# Altium schematic sheet Memory.SchDoc
size Legal; Author: Mark & Qiming; DocumentNumber: 2; SheetNumber: 2; SheetTotal: 9
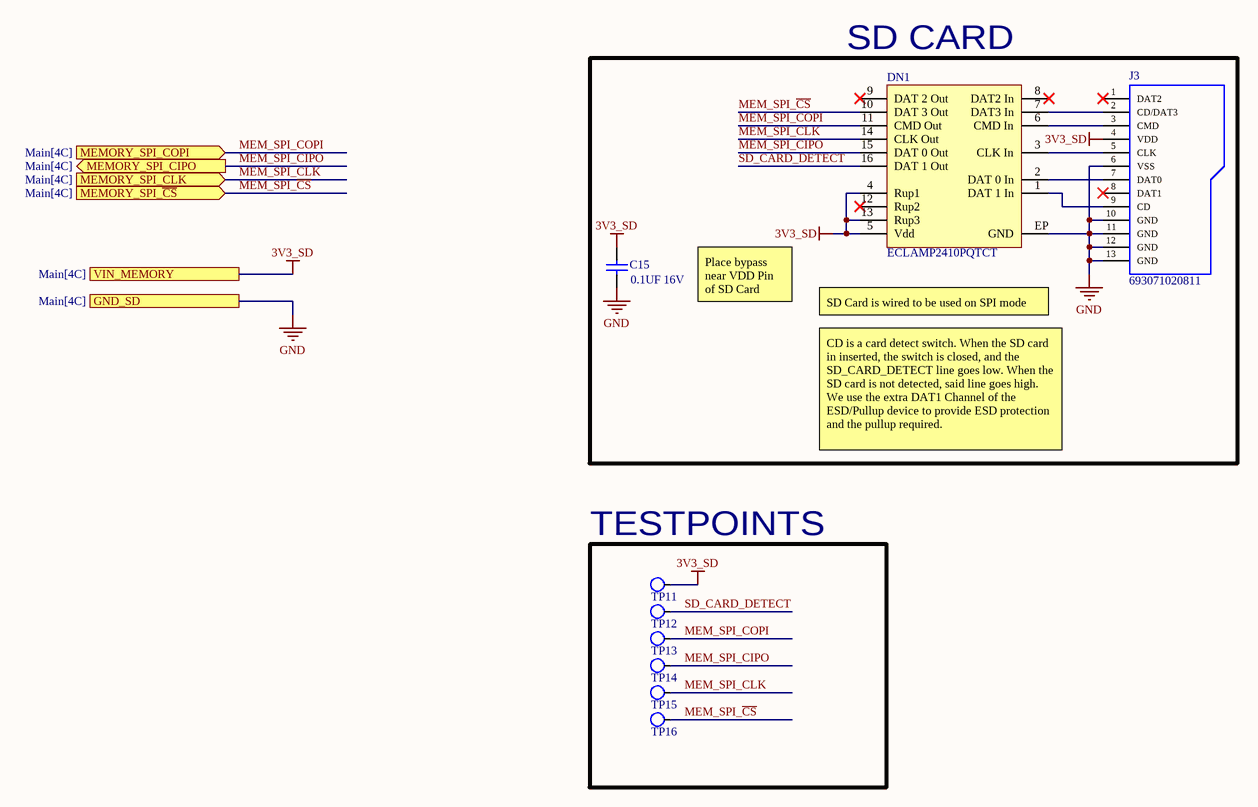
[diagram p0: Memory.SchDoc]

## Parts
C15  0.1UF 16V  [0603_CAP]
DN1  ECLAMP2410PQTCT  [ECLAMP2410PQTCT-Footprint-1]
J3  693071020811  [693071020811]
TP11  Testpad  [SMT Testpoint, 50mil]  (value not drawn)  (no BOM)
TP12  Testpad  [SMT Testpoint, 50mil]  (value not drawn)  (no BOM)
TP13  Testpad  [SMT Testpoint, 50mil]  (value not drawn)  (no BOM)
TP14  Testpad  [SMT Testpoint, 50mil]  (value not drawn)  (no BOM)
TP15  Testpad  [SMT Testpoint, 50mil]  (value not drawn)  (no BOM)
TP16  Testpad  [SMT Testpoint, 50mil]  (value not drawn)  (no BOM)

## Blocks framed on the sheet
SD CARD: C15 DN1 J3
TESTPOINTS: TP11-TP16

## Ports
GND_SD (see Main[4C]), MEMORY_SPI_CIPO (out, see Main[4C]), MEMORY_SPI_CLK (in, see Main[4C]), MEMORY_SPI_COPI (in, see Main[4C]), MEMORY_SPI_~{CS} (in, see Main[4C]), VIN_MEMORY (see Main[4C])

## Nets
3V3_SD: C15.2 DN1.4(Rup1) DN1.5(Vdd) DN1.13(Rup3) J3.4(VDD) TP11.1 ; port VIN_MEMORY
GND: C15.1 DN1.EP(GND) J3.6(VSS) J3.10(GND) J3.11(GND) J3.12(GND) J3.13(GND) ; port GND_SD
MEM_SPI_~{CS}: DN1.10(DAT_3_Out) TP16.1 ; port MEMORY_SPI_~{CS}
MEM_SPI_CIPO: DN1.15(DAT_0_Out) TP14.1 ; port MEMORY_SPI_CIPO
MEM_SPI_CLK: DN1.14(CLK_Out) TP15.1 ; port MEMORY_SPI_CLK
MEM_SPI_COPI: DN1.11(CMD_Out) TP13.1 ; port MEMORY_SPI_COPI
SD_CARD_DETECT: DN1.16(DAT_1_Out) TP12.1
NetDN1_1: DN1.1(DAT_1_In) J3.9(CD)
NetDN1_2: DN1.2(DAT_0_In) J3.7(DAT0)
NetDN1_3: DN1.3(CLK_In) J3.5(CLK)
NetDN1_6: DN1.6(CMD_In) J3.3(CMD)
NetDN1_7: DN1.7(DAT3_In) J3.2(CD/DAT3)

Not connected (* = marked no-connect by the designer): DN1 8(DAT2_In)* 9(DAT_2_Out)* 12(Rup2)*; J3 1(DAT2)* 8(DAT1)*

## Notes on the sheet
- Place bypass near VDD Pin of SD Card
- SD Card is wired to be used on SPI mode
- CD is a card detect switch. When the SD card in inserted, the switch is closed, and the SD_CARD_DETECT line goes low. When the SD card is not detected, said line goes high. We use the extra DAT1 Channel of the ESD/Pullup device to provide ESD protection and the pullup required.
- Title:
- Desc:
- Size:
- Letter
- Auth:
- Proj:
- Sheet
- of
- www.seas.upenn.edu
- Electrical and Systems Engineering

## Library data of the parts
C15 = CMP-011-000221-1: Capacitor Surface Mount 0603 Footprint 0.1UF 16V 10% Tolerance Ceramic X7R; Manufacturer P/N: CAP 0603 0.1UF 16V 10% X7R; Manufacturer: Various; Description in Visual: Cap SMT 0603 0.1UF 16V 10%  Cer X7R; PCB Package: 0603; Mount: SMT; Type: Ceramic X7R; Voltage: 16V; P/N: CAP 0603 0.1UF 16V 10% X7R; Value: 0.1UF; Tolerance: 10%
DN1 = CMP-00096-2: Trans Voltage Suppressor Diode, 5V V(RWM), Bidirectional, 7 Element, Silicon with EMI Filter; Filter Type: DATA LINE FILTER; Reach SVHC Compliant: Yes; RoHS Compliant: Yes
J3 = CMP-00419-3: WR-CRD Micro SD Card Connector Push & Push; Rated Current: 0.5A; Working Voltage: 30VAC; Contact Resistance: 100mOhm; Gender: Socket; Withstanding Voltage: 500VAC; Pin Number: 8; Mounting Technology: SMT; Source: WR-CRD.SchLib; Type: Push & Push; ComponentLink2Description: Datasheet; Packaging: Tape and Reel; ComponentLink1Description: Manufacturer; Design Item ID: 693071020811; Memory Card Type: Micro SD; Publisher: Wurth Elektronik; Operating Temperature: -40 to +85degC; ComponentLink2URL: https://katalog.we-online.com/em/datasheet/693071020811.pdf; Number of Contacts: 8; Part Number: 693071020811; Published Date: November 2019; ComponentLink1URL: http://www.we-online.de
TP11-TP16 = CMP-00049-4: Test Pad/Point (Testpoint, Testpad), for probing